# Altium schematic sheet CommandBoard.SchDoc: Commandboard interface
size A4; Organization: Institut d'Automatisation Industrielle; SheetNumber: 1; SheetTotal: 3; SVN: OUI; CurrentTime: 6; CurrentDate: 5; DocumentFullPathAndName: 8; DocumentName: 9; ModifiedDate: 13; ProjectName: <projet>
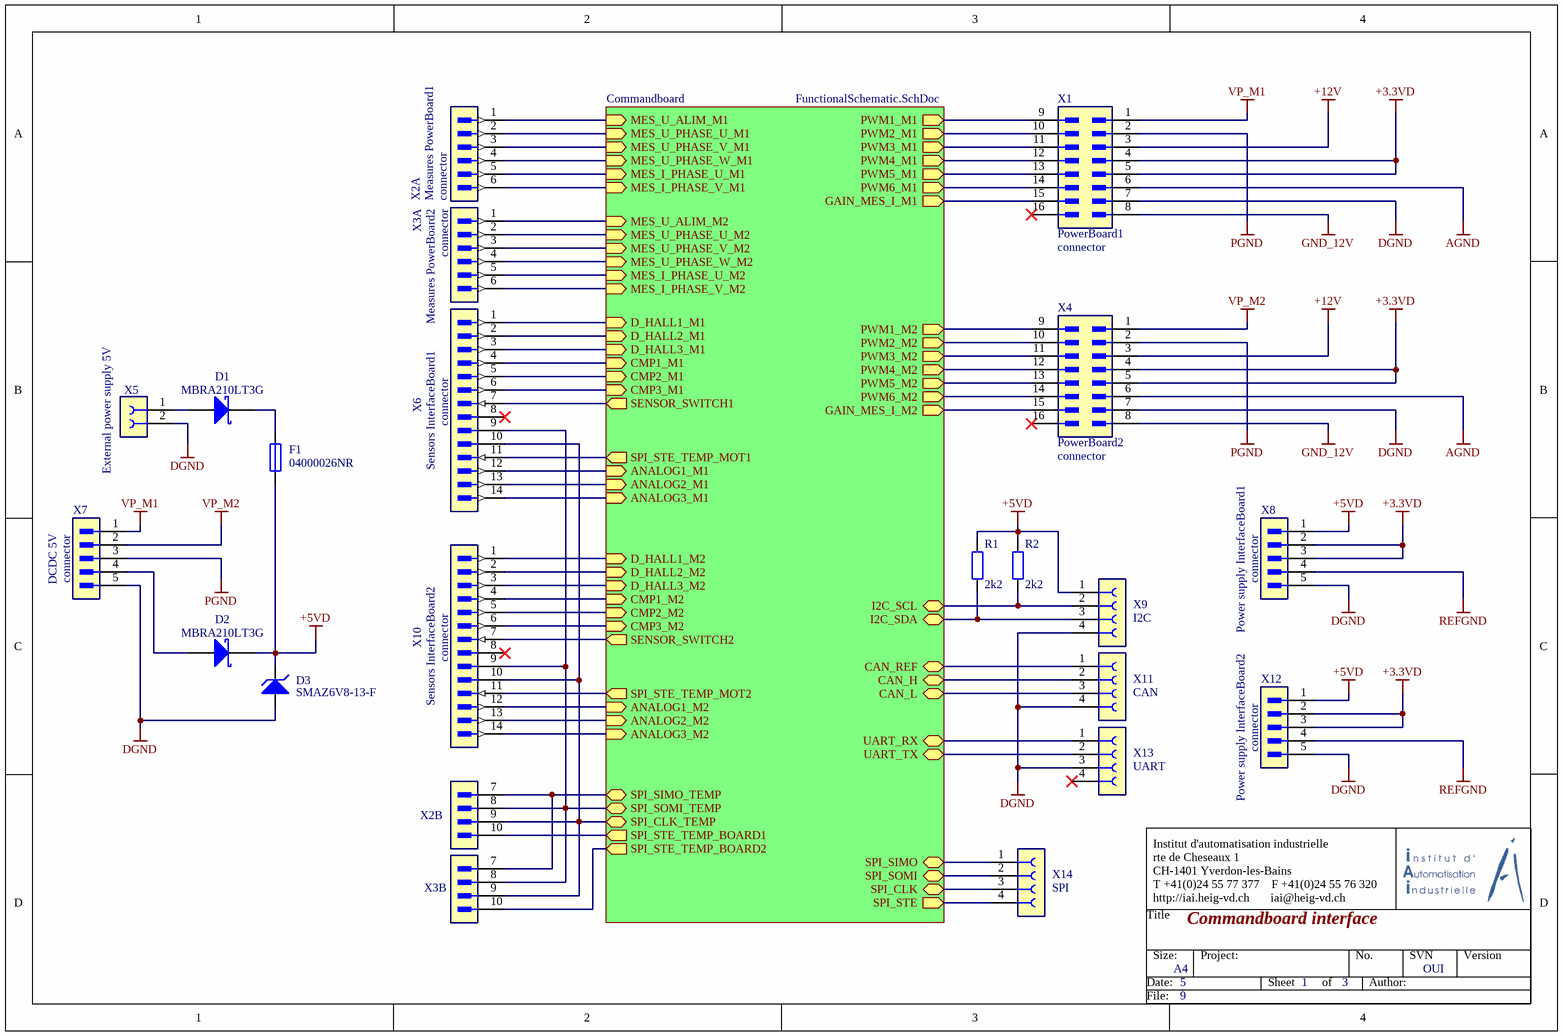
[diagram p0: CommandBoard.SchDoc]

## Parts
D1  value MBRA210LT3G  [DIOM4326X22N]  (hidden comment: DIODE SCHOTTKY 10V 2A SMA)
D2  value MBRA210LT3G  [DIOM4326X22N]  (hidden comment: DIODE SCHOTTKY 10V 2A SMA)
D3  value SMAZ6V8-13-F  [DIOM4326X22N]  (hidden comment: DIODE ZENER 6.8V 1W SMA)
F1  value 04000026NR  [FUSEC1508X06N]  (hidden comment: FUSE 1.5A 5V FAST 0603 SMD)
R1  value 2k2  [RESC1508X04N]  (hidden comment: RES SMD 2K2 0603)
R2  value 2k2  [RESC1508X04N]  (hidden comment: RES SMD 2K2 0603)
X1  Use: PowerBoard1  system: connector  [62101621021]  (hidden comment: CONNECT SMD 16pos 180°)
X2  Use: Measures PowerBoard1  system: connector  [62101021021]  (hidden comment: CONNECT SMD 10pos 180°)  (parts A,B of 2)
X3  Use: Measures PowerBoard2  system: connector  [62101021021]  (hidden comment: CONNECT SMD 10pos 180°)  (parts A,B of 2)
X4  Use: PowerBoard2  system: connector  [62101621021]  (hidden comment: CONNECT SMD 16pos 180°)
X5  Use: External power supply 5V  [WR-TBL322 3.81mm 2p]  (hidden comment: CONNECT 2pos 90°)
X6  Use: Sensors InterfaceBoard1  system: connector  [62101421021]  (hidden comment: CONNECT SMD 16pos 180°)
X7  Use: DCDC 5V  system: connector  [62000611121]  (hidden comment: CONNECT SMD 5pos 180°)
X8  Use: Power supply InterfaceBoard1  system: connector  [62000611121]  (hidden comment: CONNECT SMD 5pos 180°)
X9  Use: I2C  [TE_7-215079-4]  (hidden comment: CONNECT SMD 4pos 180°)
X10  Use: Sensors InterfaceBoard2  system: connector  [62101421021]  (hidden comment: CONNECT SMD 16pos 180°)
X11  Use: CAN  [TE_7-215079-4]  (hidden comment: CONNECT SMD 4pos 180°)
X12  Use: Power supply InterfaceBoard2  system: connector  [62000611121]  (hidden comment: CONNECT SMD 5pos 180°)
X13  Use: UART  [TE_7-215079-4]  (hidden comment: CONNECT SMD 4pos 180°)
X14  Use: SPI  [TE_7-215079-4]  (hidden comment: CONNECT SMD 4pos 180°)

## Sub-sheets
Commandboard = FunctionalSchematic.SchDoc: MES_I_PHASE_V_M1 (in), PWM4_M1 (out), MES_I_PHASE_U_M2 (in), ANALOG2_M2 (in), MES_U_PHASE_W_M1 (in), D_HALL3_M1 (in), PWM2_M1 (out), ANALOG2_M1 (in), UART_RX (bidir), PWM3_M1 (out), D_HALL2_M2 (in), SPI_SOMI (bidir), PWM4_M2 (out), PWM2_M2 (out), MES_U_ALIM_M1 (in), MES_I_PHASE_V_M2 (in), ANALOG3_M1 (in), D_HALL2_M1 (in), CAN_REF (bidir), MES_U_ALIM_M2 (in), PWM5_M2 (out), SPI_SIMO (bidir), PWM1_M2 (out), MES_I_PHASE_U_M1 (in), SPI_CLK (bidir), PWM3_M2 (out), PWM6_M2 (out), ANALOG1_M2 (in), PWM5_M1 (out), CAN_L (bidir), ANALOG3_M2 (in), I2C_SDA (bidir), PWM6_M1 (out), I2C_SCL (bidir), D_HALL3_M2 (in), PWM1_M1 (out), D_HALL1_M2 (in), UART_TX (bidir), CAN_H (bidir), ANALOG1_M1 (in), MES_U_PHASE_W_M2 (in), D_HALL1_M1 (in), SPI_SOMI_TEMP (bidir), SPI_CLK_TEMP (bidir), MES_U_PHASE_V_M1 (in), MES_U_PHASE_U_M1 (in), MES_U_PHASE_U_M2 (in), MES_U_PHASE_V_M2 (in), SPI_SIMO_TEMP (bidir), SENSOR_SWITCH1 (out), SENSOR_SWITCH2 (out), GAIN_MES_I_M1 (out), GAIN_MES_I_M2 (out), SPI_STE (out), CMP3_M1 (in), CMP1_M2 (in), SPI_STE_TEMP_BOARD1 (out), CMP1_M1 (in), SPI_STE_TEMP_MOT2 (out), SPI_STE_TEMP_MOT1 (out), CMP2_M1 (in), CMP3_M2 (in), CMP2_M2 (in), SPI_STE_TEMP_BOARD2 (out)

## Nets
+3.3VD: X1.4 X1.5 X4.4 X4.5 X8.2 X8.3 X12.2 X12.3
+5VD: D2.2(K) D3.2(K) F1.1 R1.2 R2.2 X8.1 X9.1 X12.1
+12V: X1.3 X4.3
AGND: X1.6 X4.6
DGND: D3.1(A) X1.7 X4.7 X5.2 X7.5 X8.5 X9.4 X11.4 X12.5 X13.3
GND_12V: X1.8 X4.8
PGND: X1.2 X4.2 X7.3
REFGND: X8.4 X12.4
VP_M1: X1.1 X7.1
VP_M2: X4.1 X7.2
NetD1_1: D1.1(A) X5.1
NetD1_2: D1.2(K) F1.2
NetD2_1: D2.1(A) X7.4
NetR1_1: R1.1 X9.3 ; sheet Commandboard/I2C_SDA
NetR2_1: R2.1 X9.2 ; sheet Commandboard/I2C_SCL
NetX1_9: X1.9 ; sheet Commandboard/PWM1_M1
NetX1_10: X1.10 ; sheet Commandboard/PWM2_M1
NetX1_11: X1.11 ; sheet Commandboard/PWM3_M1
NetX1_12: X1.12 ; sheet Commandboard/PWM4_M1
NetX1_13: X1.13 ; sheet Commandboard/PWM5_M1
NetX1_14: X1.14 ; sheet Commandboard/PWM6_M1
NetX1_15: X1.15 ; sheet Commandboard/GAIN_MES_I_M1
NetX2_1: X2.1 ; sheet Commandboard/MES_U_ALIM_M1
NetX2_2: X2.2 ; sheet Commandboard/MES_U_PHASE_U_M1
NetX2_3: X2.3 ; sheet Commandboard/MES_U_PHASE_V_M1
NetX2_4: X2.4 ; sheet Commandboard/MES_U_PHASE_W_M1
NetX2_5: X2.5 ; sheet Commandboard/MES_I_PHASE_U_M1
NetX2_6: X2.6 ; sheet Commandboard/MES_I_PHASE_V_M1
NetX2_7: X2.7 X3.7 ; sheet Commandboard/SPI_SIMO_TEMP
NetX2_8: X2.8 X3.8 X6.9 X10.9 ; sheet Commandboard/SPI_SOMI_TEMP
NetX2_9: X2.9 X3.9 X6.10 X10.10 ; sheet Commandboard/SPI_CLK_TEMP
NetX2_10: X2.10 ; sheet Commandboard/SPI_STE_TEMP_BOARD1
NetX3_1: X3.1 ; sheet Commandboard/MES_U_ALIM_M2
NetX3_2: X3.2 ; sheet Commandboard/MES_U_PHASE_U_M2
NetX3_3: X3.3 ; sheet Commandboard/MES_U_PHASE_V_M2
NetX3_4: X3.4 ; sheet Commandboard/MES_U_PHASE_W_M2
NetX3_5: X3.5 ; sheet Commandboard/MES_I_PHASE_U_M2
NetX3_6: X3.6 ; sheet Commandboard/MES_I_PHASE_V_M2
NetX3_10: X3.10 ; sheet Commandboard/SPI_STE_TEMP_BOARD2
NetX4_9: X4.9 ; sheet Commandboard/PWM1_M2
NetX4_10: X4.10 ; sheet Commandboard/PWM2_M2
NetX4_11: X4.11 ; sheet Commandboard/PWM3_M2
NetX4_12: X4.12 ; sheet Commandboard/PWM4_M2
NetX4_13: X4.13 ; sheet Commandboard/PWM5_M2
NetX4_14: X4.14 ; sheet Commandboard/PWM6_M2
NetX4_15: X4.15 ; sheet Commandboard/GAIN_MES_I_M2
NetX6_1: X6.1 ; sheet Commandboard/D_HALL1_M1
NetX6_2: X6.2 ; sheet Commandboard/D_HALL2_M1
NetX6_3: X6.3 ; sheet Commandboard/D_HALL3_M1
NetX6_4: X6.4 ; sheet Commandboard/CMP1_M1
NetX6_5: X6.5 ; sheet Commandboard/CMP2_M1
NetX6_6: X6.6 ; sheet Commandboard/CMP3_M1
NetX6_7: X6.7 ; sheet Commandboard/SENSOR_SWITCH1
NetX6_11: X6.11 ; sheet Commandboard/SPI_STE_TEMP_MOT1
NetX6_12: X6.12 ; sheet Commandboard/ANALOG1_M1
NetX6_13: X6.13 ; sheet Commandboard/ANALOG2_M1
NetX6_14: X6.14 ; sheet Commandboard/ANALOG3_M1
NetX10_1: X10.1 ; sheet Commandboard/D_HALL1_M2
NetX10_2: X10.2 ; sheet Commandboard/D_HALL2_M2
NetX10_3: X10.3 ; sheet Commandboard/D_HALL3_M2
NetX10_4: X10.4 ; sheet Commandboard/CMP1_M2
NetX10_5: X10.5 ; sheet Commandboard/CMP2_M2
NetX10_6: X10.6 ; sheet Commandboard/CMP3_M2
NetX10_7: X10.7 ; sheet Commandboard/SENSOR_SWITCH2
NetX10_11: X10.11 ; sheet Commandboard/SPI_STE_TEMP_MOT2
NetX10_12: X10.12 ; sheet Commandboard/ANALOG1_M2
NetX10_13: X10.13 ; sheet Commandboard/ANALOG2_M2
NetX10_14: X10.14 ; sheet Commandboard/ANALOG3_M2
NetX11_1: X11.1 ; sheet Commandboard/CAN_REF
NetX11_2: X11.2 ; sheet Commandboard/CAN_H
NetX11_3: X11.3 ; sheet Commandboard/CAN_L
NetX13_1: X13.1 ; sheet Commandboard/UART_RX
NetX13_2: X13.2 ; sheet Commandboard/UART_TX
NetX14_1: X14.1 ; sheet Commandboard/SPI_SIMO
NetX14_2: X14.2 ; sheet Commandboard/SPI_SOMI
NetX14_3: X14.3 ; sheet Commandboard/SPI_CLK
NetX14_4: X14.4 ; sheet Commandboard/SPI_STE

Not connected (* = marked no-connect by the designer): X1 16*; X4 16*; X6 8*; X10 8*; X13 4*

## Notes on the sheet
- Title
- Institut d'automatisation industrielle
  rte de Cheseaux 1
  CH-1401 Yverdon-les-Bains
  T +41(0)24 55 77 377    F +41(0)24 55 76 320
  http://iai.heig-vd.ch       iai@heig-vd.ch
- Date:
- Size:
- A4
- Project:
- Sheet
- of
- No.
- Author:
- SVN
- Version
- File:

## Library data of the parts
D1 D2 = DIODE SCHOTTKY 10V 2A SMA: Diode Schottky 10V 2A Montage en surface SMA; ComponentLink1Description: Manufacturer Link; ComponentLink1URL: http://www.infineon.com/; ComponentLink2Description: Datasheet; ComponentLink2URL: http://www.infineon.com/upload/Document/cmc_upload/documents/009/363/bat17series.pdf; Supplier 1: Digi-Key; Supplier Part Number 1: MBRA210LT3GOSCT-ND
D3 = DIODE ZENER 6.8V 1W SMA: Diodes - Zener 6,8V 1W ±5% Montage en surface SMA; Supplier 1: Digi-Key; Supplier Part Number 1: SMAZ6V8-FDICT-ND
F1 = FUSE 1.5A 5V FAST 0603 SMD: 1,5A CA 5V Fusible CC Montage sur carte (type cartouche exclu) Montage en surface 0603 (1608 métrique); Supplier 1: Digi-Key; Supplier Part Number 1: F12132CT-ND
R1 R2 = RES SMD 2K2 OHM 1% 1/10W 0603: 2,2 kOhms ±1% 0,1W, 1/10W Pavé résistif 0603 (1608 métrique) AutomobileAEC-Q200 Couche épaisse; Supplier 1: Digi-Key; Supplier Part Number 1: RMCF0603FT2K20CT-ND
X1 X4 = CONNECT SMD 16pos 2row 180° 1.27mm: Value: *
X2 X3 = CONNECT SMD 10pos 180° 1.27mm: Value: *
X5 = CONNECT 2pos 90° 3.81mm F: 2 Positions, bloc de jonction Embase, broche mâle, gainée (4 côtés) 0,150 po (3,81mm) 90°, engle droit Trou traversant; Value: WR-TBL322; Supplier 1: Digi-Key; Supplier Part Number 1: 732-2088-ND
X6 X10 = CONNECT SMD 16pos 180° 1.27mm: Value: *
X7 X8 X12 = CONNECT SMD 5pos 180° 2mm: Value: *
X9 X11 X13 X14 = CONNECT SMD 4pos 180° 2.54mm F: Connecteur, embase Montage en surface 4 positions 0,100 po (2,54mm); Value: *